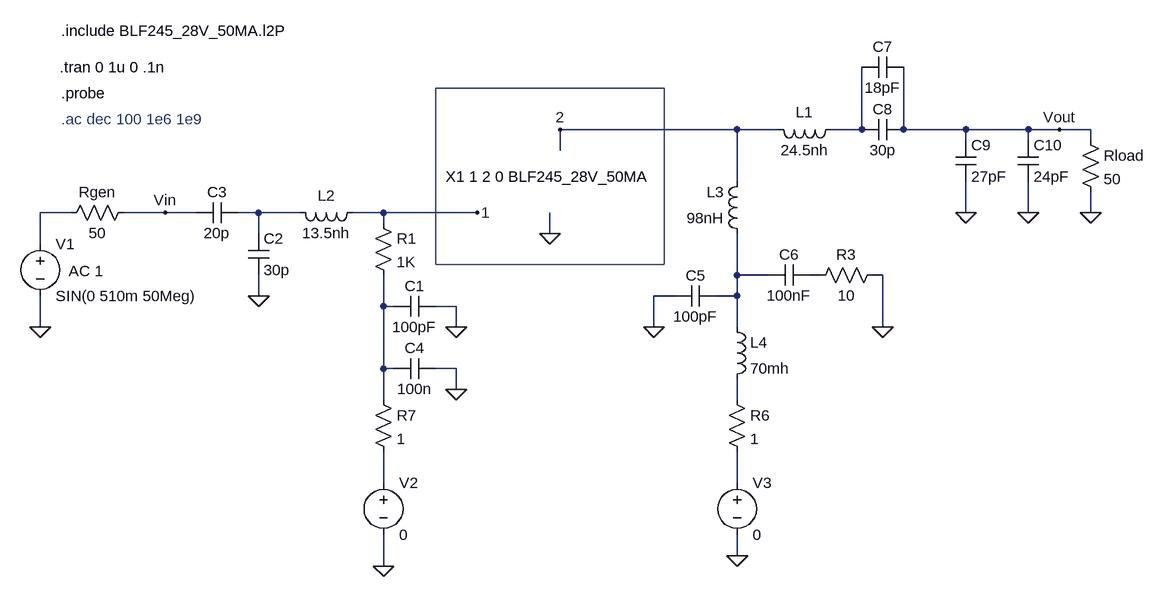
[diagram p0: schematic BlF245_pspice.asc]
BlF245_pspice.asc, the LTspice schematic file:
Version 4
SHEET 1 880 680
WIRE -1840 -208 -1840 -256
WIRE -1840 -80 -1840 -128
WIRE -1792 -256 -1840 -256
WIRE -1648 -256 -1712 -256
WIRE -1600 -256 -1648 -256
WIRE -1504 -256 -1536 -256
WIRE -1504 -224 -1504 -256
WIRE -1504 -128 -1504 -160
WIRE -1440 -256 -1504 -256
WIRE -1312 -256 -1360 -256
WIRE -1312 -240 -1312 -256
WIRE -1312 -112 -1312 -160
WIRE -1312 -16 -1312 -112
WIRE -1312 32 -1312 -16
WIRE -1312 160 -1312 112
WIRE -1312 288 -1312 240
WIRE -1296 -112 -1312 -112
WIRE -1296 -16 -1312 -16
WIRE -1200 -112 -1232 -112
WIRE -1200 -80 -1200 -112
WIRE -1200 -16 -1232 -16
WIRE -1200 16 -1200 -16
WIRE -1168 -256 -1312 -256
WIRE -1056 -224 -1056 -256
WIRE -1040 -352 -1040 -384
WIRE -896 -80 -896 -128
WIRE -864 -128 -896 -128
WIRE -768 -384 -1040 -384
WIRE -768 -304 -768 -384
WIRE -768 -160 -768 -224
WIRE -768 -128 -800 -128
WIRE -768 -128 -768 -160
WIRE -768 -80 -768 -128
WIRE -768 32 -768 0
WIRE -768 160 -768 112
WIRE -768 272 -768 240
WIRE -720 -160 -768 -160
WIRE -704 -384 -768 -384
WIRE -640 -160 -656 -160
WIRE -576 -384 -624 -384
WIRE -576 -384 -576 -480
WIRE -544 -160 -560 -160
WIRE -544 -80 -544 -160
WIRE -512 -384 -512 -480
WIRE -416 -384 -512 -384
WIRE -416 -368 -416 -384
WIRE -416 -256 -416 -304
WIRE -320 -384 -416 -384
WIRE -320 -368 -320 -384
WIRE -320 -256 -320 -304
WIRE -272 -384 -320 -384
WIRE -224 -384 -272 -384
WIRE -224 -368 -224 -384
WIRE -224 -256 -224 -288
FLAG -1056 -224 0
FLAG -1200 -80 0
FLAG -1200 16 0
FLAG -544 -80 0
FLAG -896 -80 0
FLAG -416 -256 0
FLAG -320 -256 0
FLAG -1504 -128 0
FLAG -1312 288 0
FLAG -768 272 0
FLAG -1648 -256 Vin
FLAG -272 -384 Vout
FLAG -1840 -80 0
FLAG -1168 -256 1
FLAG -1040 -384 2
FLAG -224 -256 0
SYMBOL ind -608 -400 R90
WINDOW 0 5 56 VBottom 0
WINDOW 3 32 56 VTop 0
SYMATTR InstName L1
SYMATTR Value 24.5nh
SYMBOL cap -1232 -128 R90
WINDOW 0 0 32 VBottom 0
WINDOW 3 32 32 VTop 0
SYMATTR InstName C1
SYMATTR Value 100pF
SYMBOL cap -1520 -224 R0
SYMATTR InstName C2
SYMATTR Value 30p
SYMBOL cap -1536 -272 R90
WINDOW 0 0 32 VBottom 0
WINDOW 3 32 32 VTop 0
SYMATTR InstName C3
SYMATTR Value 20p
SYMBOL res -1328 -256 R0
SYMATTR InstName R1
SYMATTR Value 1K
SYMBOL ind -752 -208 R180
WINDOW 0 36 80 Left 0
WINDOW 3 36 40 Left 0
SYMATTR InstName L3
SYMATTR Value 98nH
SYMBOL cap -864 -112 R270
WINDOW 0 32 32 VTop 0
WINDOW 3 0 32 VBottom 0
SYMATTR InstName C5
SYMATTR Value 100pF
SYMBOL cap -720 -144 R270
WINDOW 0 32 32 VTop 0
WINDOW 3 0 32 VBottom 0
SYMATTR InstName C6
SYMATTR Value 100nF
SYMBOL cap -576 -464 R270
WINDOW 0 32 32 VTop 0
WINDOW 3 0 32 VBottom 0
SYMATTR InstName C7
SYMATTR Value 18pF
SYMBOL cap -576 -368 R270
WINDOW 0 32 32 VTop 0
WINDOW 3 0 32 VBottom 0
SYMATTR InstName C8
SYMATTR Value 30p
SYMBOL ind -784 -96 R0
SYMATTR InstName L4
SYMATTR Value 70mh
SYMBOL res -544 -176 R90
WINDOW 0 0 56 VBottom 0
WINDOW 3 32 56 VTop 0
SYMATTR InstName R3
SYMATTR Value 10
SYMBOL cap -432 -368 R0
SYMATTR InstName C9
SYMATTR Value 27pF
SYMBOL cap -336 -368 R0
SYMATTR InstName C10
SYMATTR Value 24pF
SYMBOL res -240 -384 R0
SYMATTR InstName Rload
SYMATTR Value 50
SYMBOL ind -1344 -272 R90
WINDOW 0 5 56 VBottom 0
WINDOW 3 32 56 VTop 0
SYMATTR InstName L2
SYMATTR Value 13.5nh
SYMBOL res -1808 -240 R270
WINDOW 0 32 56 VTop 0
WINDOW 3 0 56 VBottom 0
SYMATTR InstName Rgen
SYMATTR Value 50
SYMBOL voltage -1840 -224 R0
WINDOW 123 44 58 Left 0
WINDOW 39 0 0 Left 0
SYMATTR InstName V1
SYMATTR Value SIN(0 510m 50Meg)
SYMATTR Value2 AC 1
SYMBOL res -784 16 R0
SYMATTR InstName R6
SYMATTR Value 1
SYMBOL res -1328 16 R0
SYMATTR InstName R7
SYMATTR Value 1
SYMBOL cap -1232 -32 R90
WINDOW 0 0 32 VBottom 0
WINDOW 3 32 32 VTop 0
SYMATTR InstName C4
SYMATTR Value 100n
SYMBOL voltage -1312 144 R0
SYMATTR InstName V2
SYMATTR Value 0
SYMBOL voltage -768 144 R0
SYMATTR InstName V3
SYMATTR Value 0
TEXT -1810 -480 Left 0 !.tran 0 1u 0 .1n
TEXT -1808 -536 Left 0 !.include BLF245_28V_50MA.l2P
TEXT -1216 -312 Left 0 !X1 1 2 0 BLF245_28V_50MA
TEXT -1808 -440 Left 0 !.probe
TEXT -1808 -400 Left 0 ;.ac dec 100 1e6 1e9
RECTANGLE Normal -880 -176 -1232 -448

The netlist it stands for:
* BlF245_pspice.asc
L1 N009 2 24.5nh
C1 0 N003 100pF
C2 N002 0 30p
C3 N002 Vin 20p
R1 1 N003 1K
L3 N005 2 98nH
C5 0 N005 100pF
C6 N005 N008 100nF
C7 N009 Vout 18pF
C8 N009 Vout 30p
L4 N005 N006 70mh
R3 0 N008 10
C9 Vout 0 27pF
C10 Vout 0 24pF
Rload Vout 0 50
L2 1 N002 13.5nh
Rgen N001 Vin 50
V1 N001 0 SIN(0 510m 50Meg) AC 1
R6 N006 N007 1
R7 N003 N004 1
C4 0 N003 100n
V2 N004 0 0
V3 N007 0 0
.tran 0 1u 0 .1n
.include BLF245_28V_50MA.l2P
X1 1 2 0 BLF245_28V_50MA
.probe
* .ac dec 100 1e6 1e9
.backanno
.end